# Altium schematic sheet Schema_bloc.SchDoc
size A4; Author: Jérémie Jean-Elie; DrawnBy: Jérémie Jean-Elie; SheetNumber: 1; SheetTotal: 7; Version: E
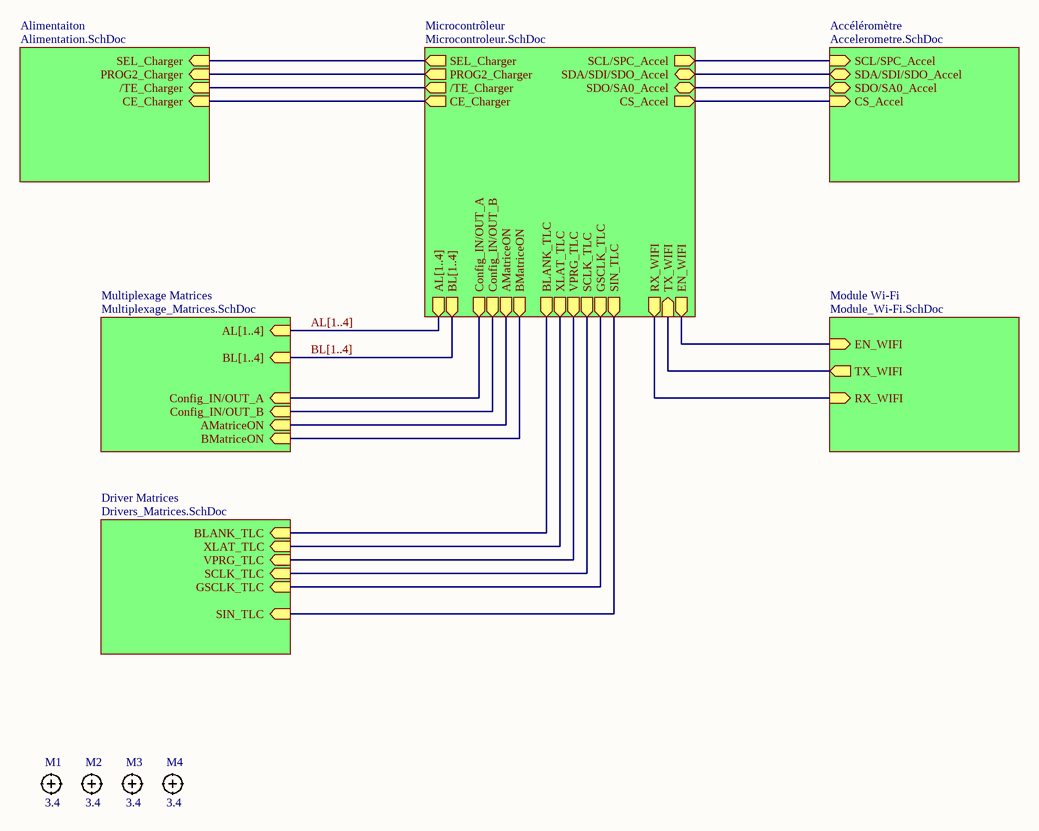
[diagram p0: Schema_bloc.SchDoc]

## Parts
M1  3.4  [MECH-UHD340]  (no BOM)
M2  3.4  [MECH-UHD340]  (no BOM)
M3  3.4  [MECH-UHD340]  (no BOM)
M4  3.4  [MECH-UHD340]  (no BOM)

## Sub-sheets
Accéléromètre = Accelerometre.SchDoc: SCL/SPC_Accel (in), SDA/SDI/SDO_Accel (bidir), SDO/SA0_Accel (bidir), CS_Accel (in)
Alimentaiton = Alimentation.SchDoc: SEL_Charger (in), PROG2_Charger (in), /TE_Charger (in), CE_Charger (in)
Driver Matrices = Drivers_Matrices.SchDoc: BLANK_TLC (in), XLAT_TLC (in), VPRG_TLC (in), SCLK_TLC (in), GSCLK_TLC (in), SIN_TLC (in)
Microcontrôleur = Microcontroleur.SchDoc: SEL_Charger (out), PROG2_Charger (out), /TE_Charger (out), CE_Charger (out), EN_WIFI (out), TX_WIFI (in), RX_WIFI (out), AL[1..4] (out), BL[1..4] (out), BLANK_TLC (out), XLAT_TLC (out), VPRG_TLC (out), SCLK_TLC (out), GSCLK_TLC (out), Config_IN/OUT_B (out), AMatriceON (out), BMatriceON (out), SIN_TLC (out), Config_IN/OUT_A (out), SCL/SPC_Accel (out), SDA/SDI/SDO_Accel (bidir), SDO/SA0_Accel (bidir), CS_Accel (out)
Module Wi-Fi = Module_Wi-Fi.SchDoc: EN_WIFI (in), TX_WIFI (out), RX_WIFI (in)
Multiplexage Matrices = Multiplexage_Matrices.SchDoc: AL[1..4] (in), BL[1..4] (in), Config_IN/OUT_A (in), AMatriceON (in), BMatriceON (in), Config_IN/OUT_B (in)

## Nets
(unnamed): sheet Alimentaiton/SEL_Charger, sheet Microcontrôleur/SEL_Charger
(unnamed): sheet Alimentaiton/PROG2_Charger, sheet Microcontrôleur/PROG2_Charger
(unnamed): sheet Alimentaiton//TE_Charger, sheet Microcontrôleur//TE_Charger
(unnamed): sheet Alimentaiton/CE_Charger, sheet Microcontrôleur/CE_Charger
(unnamed): sheet Microcontrôleur/EN_WIFI, sheet Module Wi-Fi/EN_WIFI
(unnamed): sheet Microcontrôleur/TX_WIFI, sheet Module Wi-Fi/TX_WIFI
(unnamed): sheet Microcontrôleur/RX_WIFI, sheet Module Wi-Fi/RX_WIFI
(unnamed): sheet Microcontrôleur/BLANK_TLC, sheet Driver Matrices/BLANK_TLC
(unnamed): sheet Microcontrôleur/XLAT_TLC, sheet Driver Matrices/XLAT_TLC
(unnamed): sheet Microcontrôleur/VPRG_TLC, sheet Driver Matrices/VPRG_TLC
(unnamed): sheet Microcontrôleur/SCLK_TLC, sheet Driver Matrices/SCLK_TLC
(unnamed): sheet Microcontrôleur/GSCLK_TLC, sheet Driver Matrices/GSCLK_TLC
(unnamed): sheet Microcontrôleur/Config_IN/OUT_B, sheet Multiplexage Matrices/Config_IN/OUT_B
(unnamed): sheet Microcontrôleur/AMatriceON, sheet Multiplexage Matrices/AMatriceON
(unnamed): sheet Microcontrôleur/BMatriceON, sheet Multiplexage Matrices/BMatriceON
(unnamed): sheet Microcontrôleur/SIN_TLC, sheet Driver Matrices/SIN_TLC
(unnamed): sheet Microcontrôleur/Config_IN/OUT_A, sheet Multiplexage Matrices/Config_IN/OUT_A
(unnamed): sheet Microcontrôleur/SCL/SPC_Accel, sheet Accéléromètre/SCL/SPC_Accel
(unnamed): sheet Microcontrôleur/SDA/SDI/SDO_Accel, sheet Accéléromètre/SDA/SDI/SDO_Accel
(unnamed): sheet Microcontrôleur/SDO/SA0_Accel, sheet Accéléromètre/SDO/SA0_Accel
(unnamed): sheet Microcontrôleur/CS_Accel, sheet Accéléromètre/CS_Accel

## Buses and harness runs
bus AL[1..4] = sheet Microcontrôleur/AL[1..4] = sheet Multiplexage Matrices/AL[1..4]
bus BL[1..4] = sheet Microcontrôleur/BL[1..4] = sheet Multiplexage Matrices/BL[1..4]

## Notes on the sheet
- Fichier :
- a
- Date :
- Heure :
- Version :
- Auteur :
- Modif.
- b
- c
- d
- Projet :
- No :
- Nb feuilles
- Feuille n°
- Chemin :

## Library data of the parts
M1-M4 = CMP-063-000009-1: Unplated Hole 3.4mm; PN: PN-491366; IsStocked: False; SubCategory: Mecaniques; Category: Others; Value: 3.4